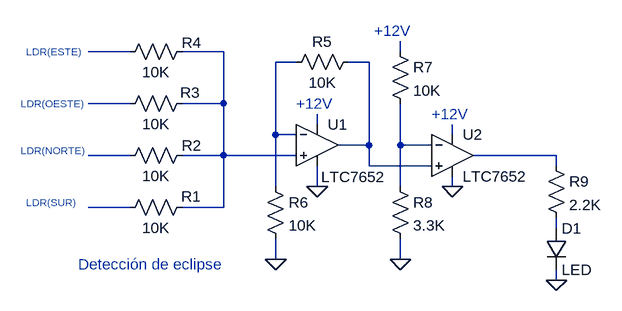
[diagram p0: schematic Draft1.asc]
Draft1.asc, the LTspice schematic file:
Version 4.1
SHEET 1 880 680
WIRE -64 -80 -128 -80
WIRE 80 -80 16 -80
WIRE 352 -80 352 -96
WIRE 192 -64 160 -64
WIRE 304 -64 272 -64
WIRE -64 0 -128 0
WIRE 80 0 80 -80
WIRE 80 0 16 0
WIRE 224 32 224 16
WIRE 160 48 160 -64
WIRE 192 48 160 48
WIRE 432 48 432 32
WIRE 304 64 304 -64
WIRE 304 64 256 64
WIRE 352 64 352 0
WIRE 400 64 352 64
WIRE -64 80 -128 80
WIRE 80 80 80 0
WIRE 80 80 16 80
WIRE 192 80 80 80
WIRE 592 80 464 80
WIRE 304 96 304 64
WIRE 400 96 304 96
WIRE 592 96 592 80
WIRE 160 128 160 48
WIRE 224 128 224 96
WIRE 352 128 352 64
WIRE 432 128 432 112
WIRE -64 160 -128 160
WIRE 80 160 80 80
WIRE 80 160 16 160
WIRE 592 192 592 176
WIRE 160 240 160 208
WIRE 352 240 352 208
WIRE 592 272 592 256
FLAG 160 240 0
FLAG 224 128 0
FLAG 352 240 0
FLAG 432 128 0
FLAG 592 272 0
SYMBOL OpAmps\\LTC7652 224 0 R0
WINDOW 3 6 113 Left 2
SYMATTR InstName U1
SYMBOL res 32 144 R90
WINDOW 0 15 2 VBottom 2
WINDOW 3 32 56 VTop 2
SYMATTR InstName R1
SYMATTR Value 10K
SYMBOL res 32 64 R90
WINDOW 0 16 1 VBottom 2
WINDOW 3 32 56 VTop 2
SYMATTR InstName R2
SYMATTR Value 10K
SYMBOL res 32 -16 R90
WINDOW 0 15 3 VBottom 2
WINDOW 3 32 56 VTop 2
SYMATTR InstName R3
SYMATTR Value 10K
SYMBOL res 32 -96 R90
WINDOW 0 18 1 VBottom 2
WINDOW 3 32 56 VTop 2
SYMATTR InstName R4
SYMATTR Value 10K
SYMBOL res 288 -80 R90
WINDOW 0 0 56 VBottom 2
WINDOW 3 32 56 VTop 2
SYMATTR InstName R5
SYMATTR Value 10K
SYMBOL res 144 112 R0
SYMATTR InstName R6
SYMATTR Value 10K
SYMBOL OpAmps\\LTC7652 432 16 R0
SYMATTR InstName U2
SYMBOL res 336 -96 R0
SYMATTR InstName R7
SYMATTR Value 10K
SYMBOL res 336 112 R0
SYMATTR InstName R8
SYMATTR Value 3.3K
SYMBOL res 576 80 R0
SYMATTR InstName R9
SYMATTR Value 2.2K
SYMBOL diode 576 192 R0
SYMATTR InstName D1
SYMATTR Value LED
TEXT -224 -80 Left 1 ;LDR(ESTE)
TEXT 192 0 Left 2 ;+12V
TEXT 312 -112 Left 2 ;+12V
TEXT 400 16 Left 2 ;+12V
TEXT -144 248 Left 2 ;Detección de eclipse
TEXT -232 0 Left 1 ;LDR(OESTE)
TEXT -232 72 Left 1 ;LDR(NORTE)
TEXT -224 152 Left 1 ;LDR(SUR)

The netlist it stands for:
* Draft1.asc
X§U1 N002 N004 N007 0 N005 LTC1052  ; LTC7652, pins In+ In- V+ V- OUT
R1 N002 N012 10K
R2 N002 N010 10K
R3 N002 N006 10K
R4 N002 N001 10K
R5 N005 N004 10K
R6 N004 0 10K
X§U2 N005 N009 N008 0 N011 LTC1052  ; LTC7652, pins In+ In- V+ V- OUT
R7 N003 N009 10K
R8 N009 0 3.3K
R9 N011 N013 2.2K
D1 N013 0 LED
.model D D
.lib standard.dio
* LDR(ESTE)
* +12V
* +12V
* +12V
* Detección de eclipse
* LDR(OESTE)
* LDR(NORTE)
* LDR(SUR)
.backanno
.end